# Altium schematic sheet eboxv1.SchDoc
size A; SheetNumber: 1; SheetTotal: 1
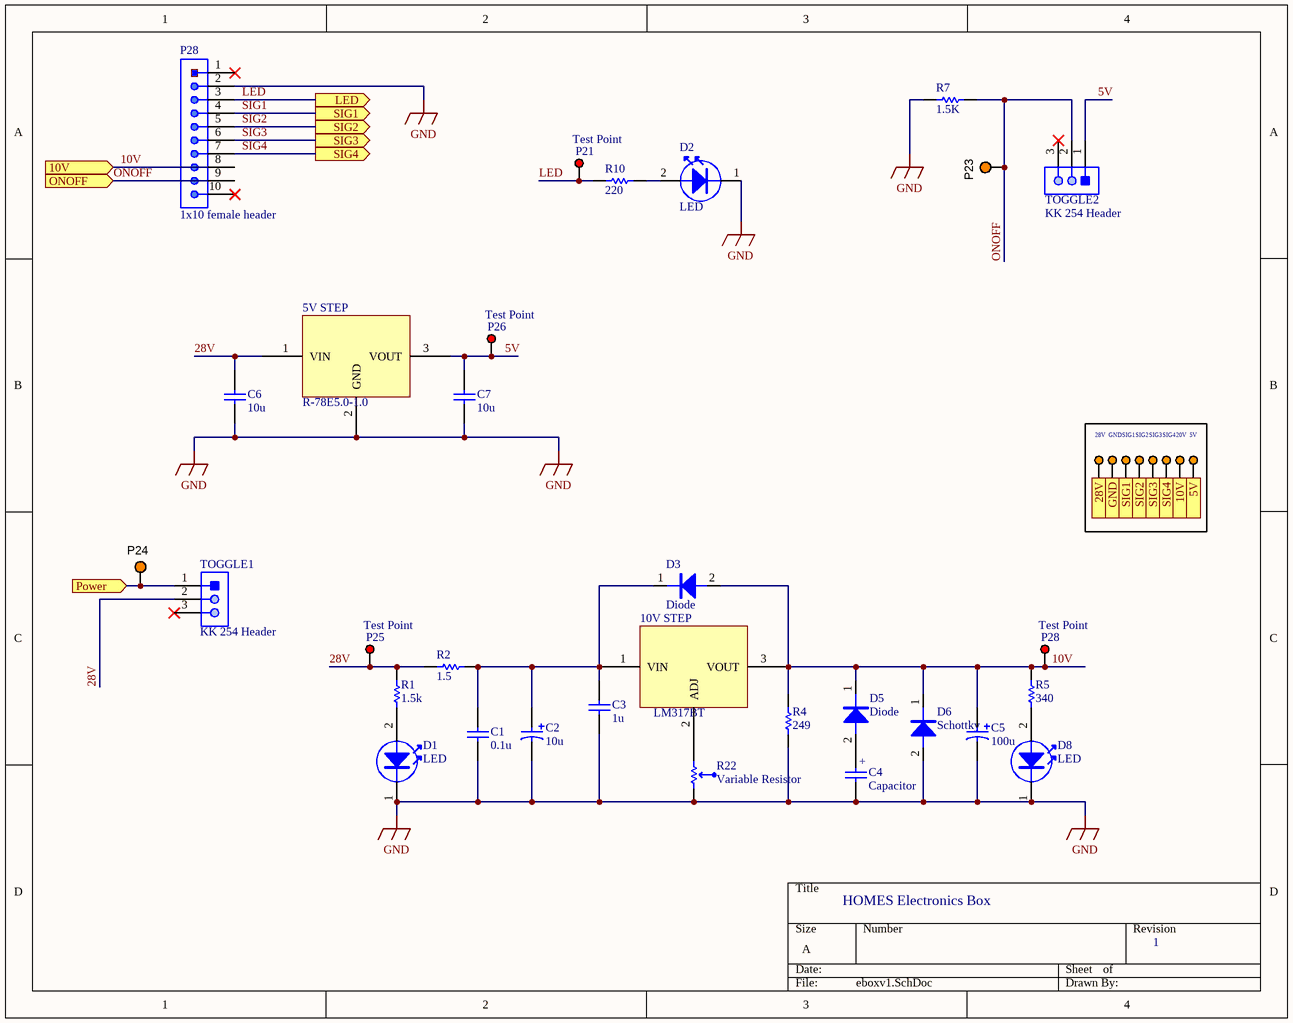
[diagram p0: eboxv1.SchDoc]

## Parts
(Parts that share a designator on the sheet are numbered #1, #2 ... from top to bottom, then left to right.)
5V_STEP  R-78E5.0-1.0  [Step Down Converter]
10V_STEP  LM317BT  [Linear Regulator]
C1  0.1u  [0.1uF]
C2  10u  [10uF Tantalum]
C3  1u  [1uF]
C4  Capacitor  [1uF]
C5  100u  [100uF Tantalum]
C6  10u  [10uF]
C7  10u  [10uF]
D1  LED  [LED 12V Thru Hole]
D2  LED  [LED 5V Arduino Thru Hole]
D3  Diode  [Protective Diode]
D5  Diode  [Protective Diode]
D6  Schottky  [Schottky Diode]
D8  LED  [LED 5V Thru Hole]
P21  Test Point  [Test Point]
P23  (no value)  [KSTN-5003]
P24  5003  [KSTN-5003]  (value not drawn)
P25  Test Point  [Test Point]
P26  Test Point  [Test Point]
P28#1  1x10 female header  [1x10 header pin]
P28#2  Test Point  [Test Point]
P35  28V  [Via]
P36  GND  [Via]
P37  SIG1  [Via]
P38  SIG2  [Via]
P39  SIG3  [Via]
P40  SIG4  [Via]
P41  20V  [Via]
P42  5V  [Via]
R1  1.5k  [LV Resistor]
R2  1.5  [1.5 Ohm]
R4  249  [249 Ohm]
R5  340  [340 Ohm]
R7  1.5K  [LV Resistor]
R10  220  [Arduino Resistors]
R22  Variable Resistor
TOGGLE1  KK 254 Header  [3x1 KK Molex]
TOGGLE2  KK 254 Header  [3x1 KK Molex]

## Ports
5V, 10V, 10V (in), 28V, GND, LED (out), ONOFF (in), Power (in), SIG1, SIG1 (out), SIG2, SIG2 (out), SIG3, SIG3 (out), SIG4, SIG4 (out)

## Nets
GND: 5V_STEP.2(GND) C1.1 C2.1 C3.1 C4.1 C5.1 C6.1 C7.1 D1.1 D2.1 D8.1 R4.2 R7.2 R22.2
5V: 5V_STEP.3(VOUT) C7.2 P26.1 TOGGLE2.1
10V: 10V_STEP.3(VOUT) C5.2 P28#1.8 P28#2.1 R4.1 R5.1 ; port 10V
28V: 5V_STEP.1(VIN) C6.2 P25.1 R1.1 R2.2 TOGGLE1.2
LED: P21.1 R10.2 ; port LED
ONOFF: P23.1 P28#1.9 R7.1 TOGGLE2.2 ; port ONOFF
Power: P24.1 TOGGLE1.1 ; port Power
SIG1: port SIG1
SIG2: port SIG2
SIG3: port SIG3
SIG4: port SIG4
Net10V_STEP_1: 10V_STEP.1(VIN) C1.2 C2.2 C3.2 R2.1
Net10V_STEP_2: 10V_STEP.2(ADJ) R22.1
NetD1_2: D1.2 R1.2
NetD2_2: D2.2 R10.1
NetD8_2: D8.2 R5.2

Not connected (* = marked no-connect by the designer): C4 2; D3 1 2; D5 1 2; D6 1 2; P28#1 1 2 3 4 5 6 7 10; P35 1; P36 1; P37 1; P38 1; P39 1; P40 1; P41 1; P42 1; TOGGLE1 3*; TOGGLE2 3*

## Notes on the sheet
- (near C4) +
- HOMES Electronics Box
- 1

## Library data of the parts
5V_STEP = Step Down Converter: Step-Down Converter
10V_STEP = Linear Regulator
C1 C3 C6 C7 = Capacitor
C2 C5 = Tantalum Capacitor
D6 = Diode
P23 P24 = CMP-002-00037-2: Test Point, Orange, Height 4.6 mm, Tail Length 3 mm, 1-Pin THD, RoHS; Manufacturer: Keystone; Colour: Orange; Packaging: Bulk; Package Description: 1-Pin Through Hole Device, Dia 2.54 mm; Pins: 1; Package Reference: 5003; Datasheet Version: Jun-15; Case/Package: 5003; Mounting Technology: TH; Connector Type: TestPoint; Diameter: 2.54mm; Contact Material: Bronze; Datasheet URL: http://keyelco.com/userAssets/file/M65p56.pdf; Manufacturer URL: http://www.keyelco.com/; Package Quantity: 10; Contact Plating: Tin; RoHS Compliant: True
P28#1 = 1x10 female header: 5-535541-8
P35-P42 = Output Point: Thru hole via
R1 R2 R4 R5 R7 R10 = Resistor
R22 = Variable Resistor: Solder one at a time: 1.5k, 1.69k, 1.91k, 2.1k, 1.32k, 2.49k, 2.67k, 2.87k
TOGGLE1 = KK 254 1x3 male header: Switch
TOGGLE2 = KK 254 1x3 male header: Button